# EAGLE design Open EVI (EAGLE 7.6.0)
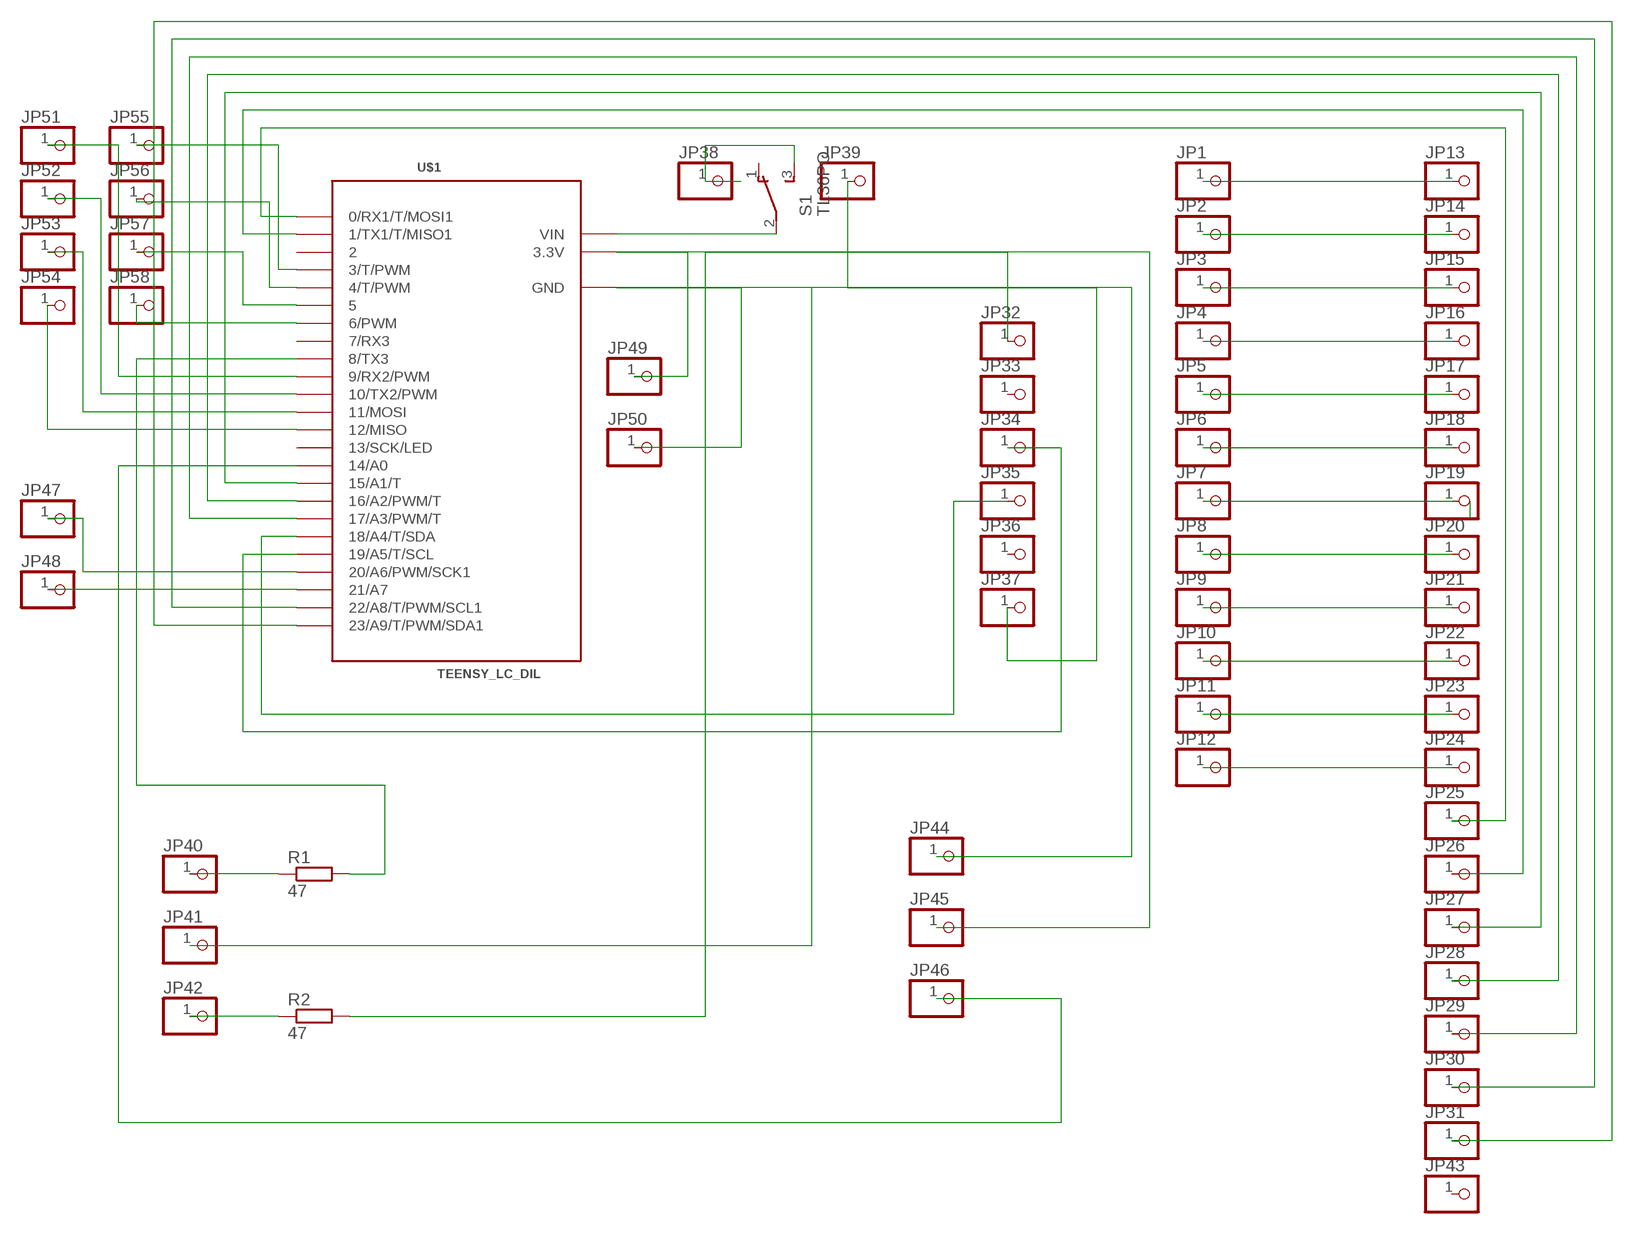
[diagram p0: schematic, sheet 1]

## Parts
JP1  PINHD-1X1  [1X01]
JP2  PINHD-1X1  [1X01]
JP3  PINHD-1X1  [1X01]
JP4  PINHD-1X1  [1X01]
JP5  PINHD-1X1  [1X01]
JP6  PINHD-1X1  [1X01]
JP7  PINHD-1X1  [1X01]
JP8  PINHD-1X1  [1X01]
JP9  PINHD-1X1  [1X01]
JP10  PINHD-1X1  [1X01]
JP11  PINHD-1X1  [1X01]
JP12  PINHD-1X1  [1X01]
JP13  PINHD-1X1  [1X01]
JP14  PINHD-1X1  [1X01]
JP15  PINHD-1X1  [1X01]
JP16  PINHD-1X1  [1X01]
JP17  PINHD-1X1  [1X01]
JP18  PINHD-1X1  [1X01]
JP19  PINHD-1X1  [1X01]
JP20  PINHD-1X1  [1X01]
JP21  PINHD-1X1  [1X01]
JP22  PINHD-1X1  [1X01]
JP23  PINHD-1X1  [1X01]
JP24  PINHD-1X1  [1X01]
JP25  PINHD-1X1  [1X01]
JP26  PINHD-1X1  [1X01]
JP27  PINHD-1X1  [1X01]
JP28  PINHD-1X1  [1X01]
JP29  PINHD-1X1  [1X01]
JP30  PINHD-1X1  [1X01]
JP31  PINHD-1X1  [1X01]
JP32  PINHD-1X1  [1X01]
JP33  PINHD-1X1  [1X01]
JP34  PINHD-1X1  [1X01]
JP35  PINHD-1X1  [1X01]
JP36  PINHD-1X1  [1X01]
JP37  PINHD-1X1  [1X01]
JP38  PINHD-1X1  [1X01]
JP39  PINHD-1X1  [1X01]
JP40  PINHD-1X1  [1X01]
JP41  PINHD-1X1  [1X01]
JP42  PINHD-1X1  [1X01]
JP43  PINHD-1X1  [1X01]
JP44  PINHD-1X1  [1X01]
JP45  PINHD-1X1  [1X01]
JP46  PINHD-1X1  [1X01]
JP47  PINHD-1X1  [1X01]
JP48  PINHD-1X1  [1X01]
JP49  PINHD-1X1  [1X01]
JP50  PINHD-1X1  [1X01]
JP51  PINHD-1X1  [1X01]
JP52  PINHD-1X1  [1X01]
JP53  PINHD-1X1  [1X01]
JP54  PINHD-1X1  [1X01]
JP55  PINHD-1X1  [1X01]
JP56  PINHD-1X1  [1X01]
JP57  PINHD-1X1  [1X01]
JP58  PINHD-1X1  [1X01]
R1  47  R-EU_0207/7  [0207/7]
R2  47  R-EU_0207/7  [0207/7]
S1  TL36PO  [TL3XPO]
U$1  TEENSY_LC_DIL  [TEENSY_3.0-3.2&LC_DIL]

## Nets
GND: JP37.1 JP39.1 JP41.1 JP44.1 JP50.1 U$1.AGND(GND) U$1.GND
N$1: JP1.1 JP13.1
N$2: JP2.1 JP14.1
N$3: JP3.1 JP15.1
N$4: JP4.1 JP16.1
N$5: JP5.1 JP17.1
N$6: JP6.1 JP18.1
N$8: JP7.1 JP19.1
N$9: JP8.1 JP20.1
N$10: JP9.1 JP21.1
N$11: JP10.1 JP22.1
N$12: JP11.1 JP23.1
N$13: JP25.1 U$1.0(0/RX1/T/MOSI1)
N$14: JP12.1 JP24.1
N$15: JP26.1 U$1.1(1/TX1/T/MISO1)
N$16: JP27.1 U$1.15/A1(15/A1/T)
N$17: JP28.1 U$1.16/A2(16/A2/PWM/T)
N$18: JP29.1 U$1.17/A3(17/A3/PWM/T)
N$19: JP30.1 U$1.22/A8(22/A8/T/PWM/SCL1)
N$20: JP31.1 U$1.23/A9(23/A9/T/PWM/SDA1)
N$21: JP32.1 JP45.1 JP49.1 R2.2 U$1.3.3V
N$22: JP47.1 U$1.20/A6(20/A6/PWM/SCK1)
N$23: JP34.1 U$1.19/A5(19/A5/T/SCL)
N$24: JP35.1 U$1.18/A4(18/A4/T/SDA)
N$25: JP38.1 S1.3(S)
N$26: R1.2 U$1.8(8/TX3)
N$27: JP40.1 R1.1
N$28: JP42.1 R2.1
N$29: JP46.1 U$1.14/A0
N$30: S1.2(P) U$1.VIN
N$31: JP48.1 U$1.21/A7
N$32: JP51.1 U$1.9(9/RX2/PWM)
N$33: JP52.1 U$1.10(10/TX2/PWM)
N$34: JP53.1 U$1.11(11/MOSI)
N$35: JP54.1 U$1.12(12/MISO)
N$36: JP55.1 U$1.3(3/T/PWM)
N$37: JP56.1 U$1.4(4/T/PWM)
N$38: JP57.1 U$1.5
N$39: JP58.1 U$1.6(6/PWM)
Unconnected: JP33.1 JP36.1 JP43.1 S1.1(O) U$1.2 U$1.7(7/RX3) U$1.13(13/SCK/LED)

## Library data of the parts
JP1-JP58 = pinhead:PINHD-1X1: PIN HEADER
R1 R2 = resistor:R-EU_: RESISTOR, European symbol
S1 = switch:TL36PO: TINY SWITCH ON - ON Source: http://www2.produktinfo.conrad.com/datenblaetter/700000-724999/705152-da-01-de-Subminiaturschalter_TL_36YO.pdf
U$1 = Teensy_3_and_LC_Series_Boards_v1.4:TEENSY_LC_DIL

## Board
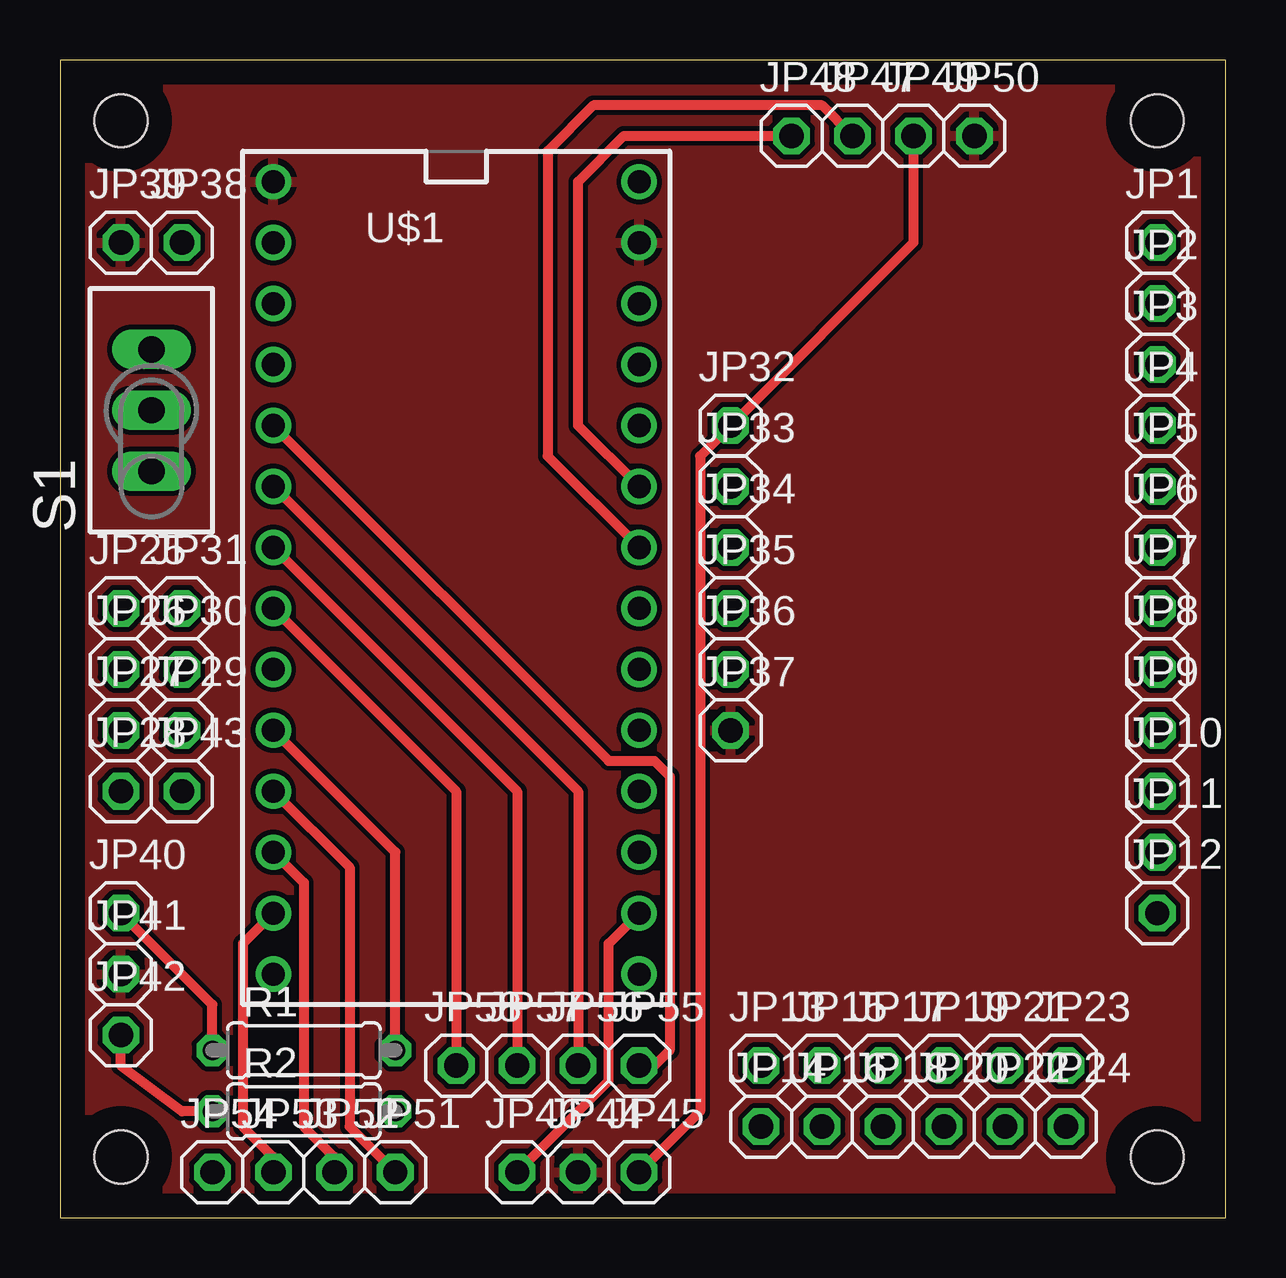
[diagram p1: board, top side]
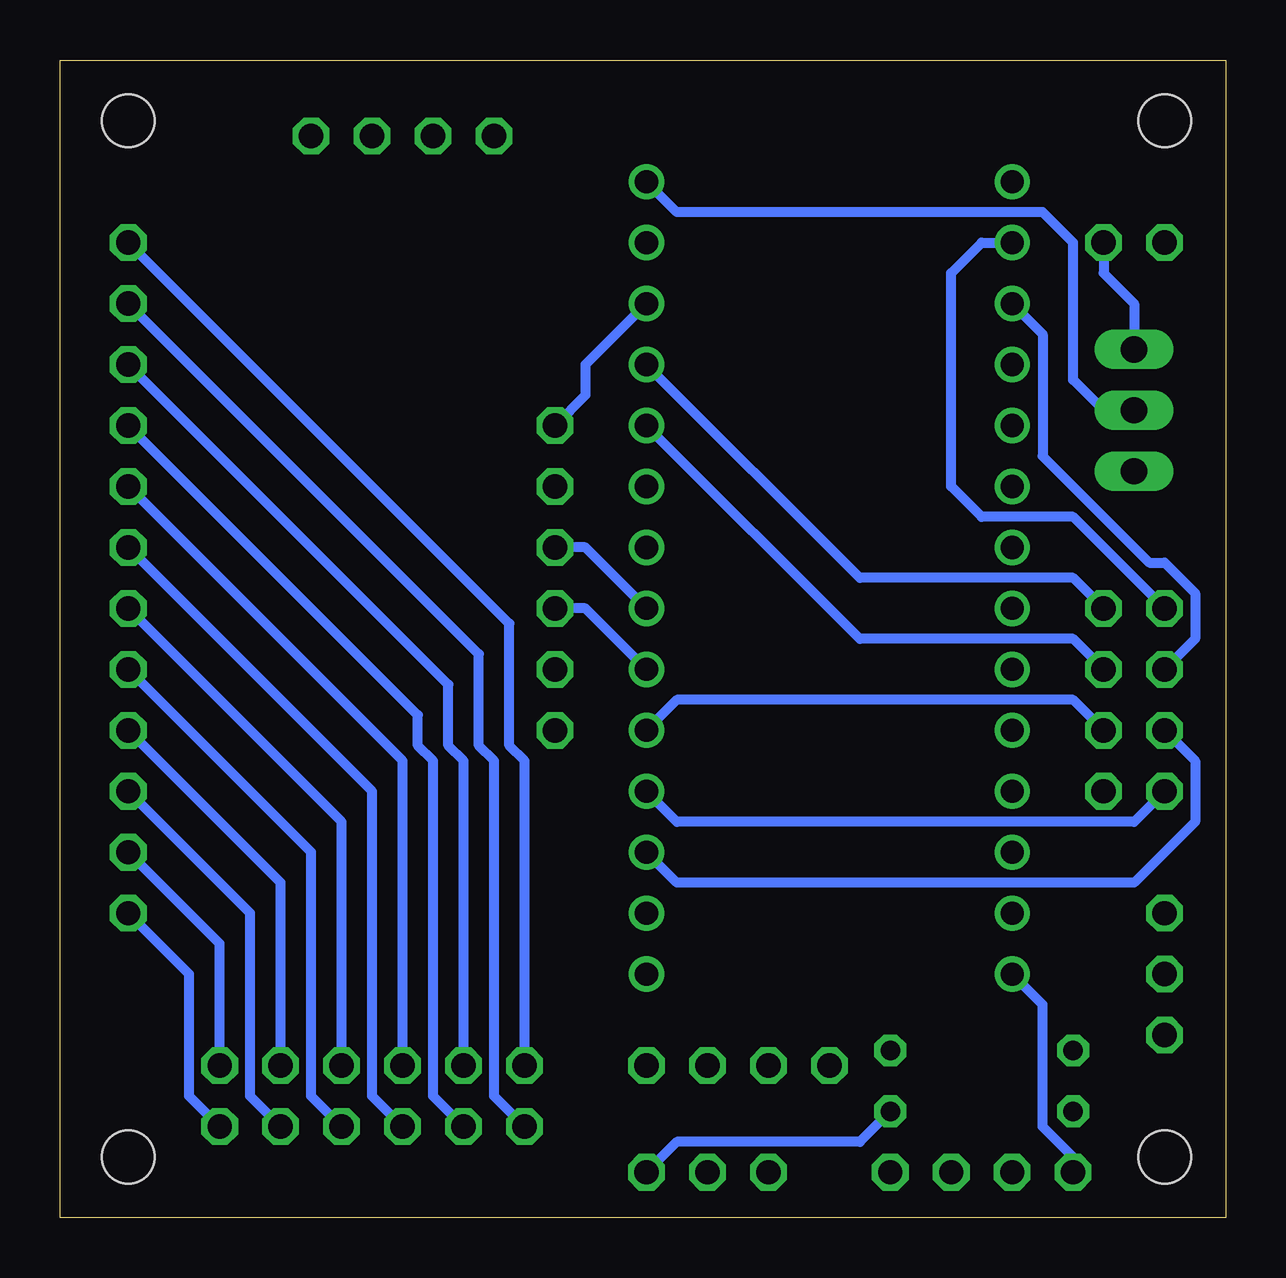
[diagram p2: board, bottom side, seen from below]

Size 48.56 x 48.25 mm. Coordinates in mm from the lower left corner, seen from the top.
Outline: 0,0 48.56,0 48.56,48.25 0,48.25 0,0
Copper layers (1*16): Top 0.035mm / dielectric 1.5mm / Bottom 0.035mm
Design rules "default": minimum track width 10mil, minimum drill 24mil, track to track 8mil, track to pad 8mil, pad to pad 8mil, via to via 8mil, smd to smd 8mil, copper to edge 40mil, drill to drill 8mil, minimum pad ring 10mil, minimum via ring 8mil, stop-mask expansion 4mil, vias tented up to drill 0mil, thermal gap 10mil
Holes 2.2 mm at 2.54,45.72 45.72,45.72 2.54,2.54 45.72,2.54

### Footprints (pad centres in the part's own frame; a part is rotated, then mirrored left to right if it is on the bottom)
1X01 = drill 1.016 octagon: 1 0,0
0207/7 = drill 0.813 octagon: 1 -3.81,0; 2 3.81,0
TL3XPO = drill 1.1 pad 1.422 long: 1 -2.54,0; 2 0,0; 3 2.54,0
TEENSY_3.0-3.2&LC_DIL = drill 0.965: 0 -7.62,13.97; 1 -7.62,11.43; 2 -7.62,8.89; 3 -7.62,6.35; 3.3V 7.62,11.43; 4 -7.62,3.81; 5 -7.62,1.27; 6 -7.62,-1.27; 7 -7.62,-3.81; 8 -7.62,-6.35; 9 -7.62,-8.89; 10 -7.62,-11.43; 11 -7.62,-13.97; 12 -7.62,-16.51; 13 7.62,-16.51; 14/A0 7.62,-13.97; 15/A1 7.62,-11.43; 16/A2 7.62,-8.89; 17/A3 7.62,-6.35; 18/A4 7.62,-3.81; 19/A5 7.62,-1.27; 20/A6 7.62,1.27; 21/A7 7.62,3.81; 22/A8 7.62,6.35; 23/A9 7.62,8.89; AGND 7.62,13.97; GND -7.62,16.51; VIN 7.62,16.51

### Placement (x,y rotation side)
JP1  45.72,40.64 0 top
JP2  45.72,38.1 0 top
JP3  45.72,35.56 0 top
JP4  45.72,33.02 0 top
JP5  45.72,30.48 0 top
JP6  45.72,27.94 0 top
JP7  45.72,25.4 0 top
JP8  45.72,22.86 0 top
JP9  45.72,20.32 0 top
JP10  45.72,17.78 0 top
JP11  45.72,15.24 0 top
JP12  45.72,12.7 0 top
JP13  29.21,6.35 0 top
JP14  29.21,3.81 0 top
JP15  31.75,6.35 0 top
JP16  31.75,3.81 0 top
JP17  34.29,6.35 0 top
JP18  34.29,3.81 0 top
JP19  36.83,6.35 0 top
JP20  36.83,3.81 0 top
JP21  39.37,6.35 0 top
JP22  39.37,3.81 0 top
JP23  41.91,6.35 0 top
JP24  41.91,3.81 0 top
JP25  2.54,25.4 0 top
JP26  2.54,22.86 0 top
JP27  2.54,20.32 0 top
JP28  2.54,17.78 0 top
JP29  5.08,20.32 0 top
JP30  5.08,22.86 0 top
JP31  5.08,25.4 0 top
JP32  27.94,33.02 0 top
JP33  27.94,30.48 0 top
JP34  27.94,27.94 0 top
JP35  27.94,25.4 0 top
JP36  27.94,22.86 0 top
JP37  27.94,20.32 0 top
JP38  5.08,40.64 0 top
JP39  2.54,40.64 0 top
JP40  2.54,12.7 0 top
JP41  2.54,10.16 0 top
JP42  2.54,7.62 0 top
JP43  5.08,17.78 0 top
JP44  21.59,1.9 0 top
JP45  24.13,1.9 0 top
JP46  19.05,1.9 0 top
JP47  33.02,45.09 0 top
JP48  30.48,45.09 0 top
JP49  35.56,45.09 0 top
JP50  38.1,45.09 0 top
JP51  13.97,1.9 0 top
JP52  11.43,1.9 0 top
JP53  8.89,1.9 0 top
JP54  6.35,1.9 0 top
JP55  24.13,6.35 0 top
JP56  21.59,6.35 0 top
JP57  19.05,6.35 0 top
JP58  16.51,6.35 0 top
R1  10.16,6.98 0 top
R2  10.16,4.45 0 top
S1  3.81,33.65 90 top
U$1  16.51,26.67 0 top

### Tracks (layer width: path | path; a pad name or v marks a point on that pad's centre or on a via)
GND
  pour Top: 0,48.26 48.26,48.26 48.26,0 0,0
N$1
  Bottom 0.406: JP13.1 29.21,19.05 29.84,19.68 29.84,24.76 JP1.1
N$2
  Bottom 0.406: JP14.1 30.48,5.08 30.48,19.05 31.12,19.68 31.12,23.49 JP2.1
N$3
  Bottom 0.406: JP15.1 31.75,19.05 32.38,19.68 32.38,22.22 JP3.1
N$4
  Bottom 0.406: JP16.1 33.02,5.08 33.02,19.05 33.66,19.68 33.66,20.95 JP4.1
N$5
  Bottom 0.406: JP17.1 34.29,19.05 JP5.1
N$6
  Bottom 0.406: JP18.1 35.56,5.08 35.56,17.78 JP6.1
N$8
  Bottom 0.406: JP19.1 36.83,16.51 JP7.1
N$9
  Bottom 0.406: JP20.1 38.1,5.08 38.1,15.24 JP8.1
N$10
  Bottom 0.406: JP21.1 39.37,13.97 JP9.1
N$11
  Bottom 0.406: JP22.1 40.64,5.08 40.64,12.7 JP10.1
N$12
  Bottom 0.406: JP23.1 41.91,11.43 JP11.1
N$13
  Bottom 0.406: JP25.1 6.35,29.21 10.16,29.21 11.43,30.48 11.43,39.37 10.16,40.64 U$1.0
N$14
  Bottom 0.406: JP24.1 43.18,5.08 43.18,10.16 JP12.1
N$15
  Bottom 0.406: U$1.1 7.62,36.83 7.62,31.75 3.18,27.3 2.54,27.3 1.27,26.03 1.27,24.13 JP26.1
N$16
  Bottom 0.406: JP27.1 1.27,19.05 1.27,16.51 3.81,13.97 22.86,13.97 U$1.15/A1
N$17
  Bottom 0.406: JP28.1 3.81,16.51 22.86,16.51 U$1.16/A2
N$18
  Bottom 0.406: JP29.1 6.35,21.59 22.86,21.59 U$1.17/A3
N$19
  Bottom 0.406: JP30.1 6.35,24.13 15.24,24.13 U$1.22/A8
N$20
  Bottom 0.406: JP31.1 6.35,26.67 15.24,26.67 U$1.23/A9
N$21
  Top 0.406: JP45.1 26.67,4.45 26.67,31.75 JP32.1 35.56,40.64 JP49.1
  Bottom 0.406: R2.2 15.24,3.17 22.86,3.17 JP45.1 | U$1.3.3V 26.67,35.56 26.67,34.29 JP32.1
N$22
  Top 0.406: JP47.1 31.75,46.35 22.23,46.35 20.32,44.45 20.32,31.75 U$1.20/A6
N$23
  Bottom 0.406: U$1.19/A5 26.67,27.94 JP34.1
N$24
  Bottom 0.406: U$1.18/A4 26.67,25.4 JP35.1
N$25
  Bottom 0.406: JP38.1 5.08,39.37 3.81,38.1 S1.3
N$26
  Top 0.406: R1.2 13.97,15.24 U$1.8
N$27
  Top 0.406: R1.1 6.35,8.89 JP40.1
N$28
  Top 0.406: R2.1 5.08,4.45 2.54,6.35 JP42.1
N$29
  Top 0.406: JP46.1 22.86,5.71 22.86,11.43 U$1.14/A0
N$30
  Bottom 0.406: S1.2 5.08,33.65 6.35,34.92 6.35,40.64 7.62,41.91 22.86,41.91 U$1.VIN
N$31
  Top 0.406: U$1.21/A7 21.59,33.02 21.59,43.18 23.49,45.09 JP48.1
N$32
  Top 0.406: U$1.9 12.07,14.6 12.07,3.81 JP51.1
N$33
  Top 0.406: U$1.10 10.16,13.97 10.16,3.81 11.43,2.54 JP52.1
N$34
  Top 0.406: U$1.11 7.62,11.43 7.62,3.81 8.89,2.54 JP53.1
N$35
  Bottom 0.406: JP54.1 6.35,2.54 7.62,3.81 7.62,8.89 U$1.12
N$36
  Top 0.406: U$1.3 22.86,19.05 24.77,19.05 25.4,18.41 25.4,6.98 24.77,6.35 JP55.1
N$37
  Top 0.406: U$1.4 21.59,17.78 JP56.1
N$38
  Top 0.406: U$1.5 19.05,17.78 JP57.1
N$39
  Top 0.406: U$1.6 16.51,17.78 JP58.1

### Text on the board
tScreen: Johan Berglund 2017 | A6 | A7 | Vc | GND | Open EVI testing board | GND | Vin | PWR | TEENSY | MPR121 | TOUCH | MIDI | OUT | GND | TOUCH | + | 47 | 3 | 6 | 47 | A0 | GND | Vc | BC | 9 | 12